# Altium project 5V-3.3V SMPS.PrjPcb
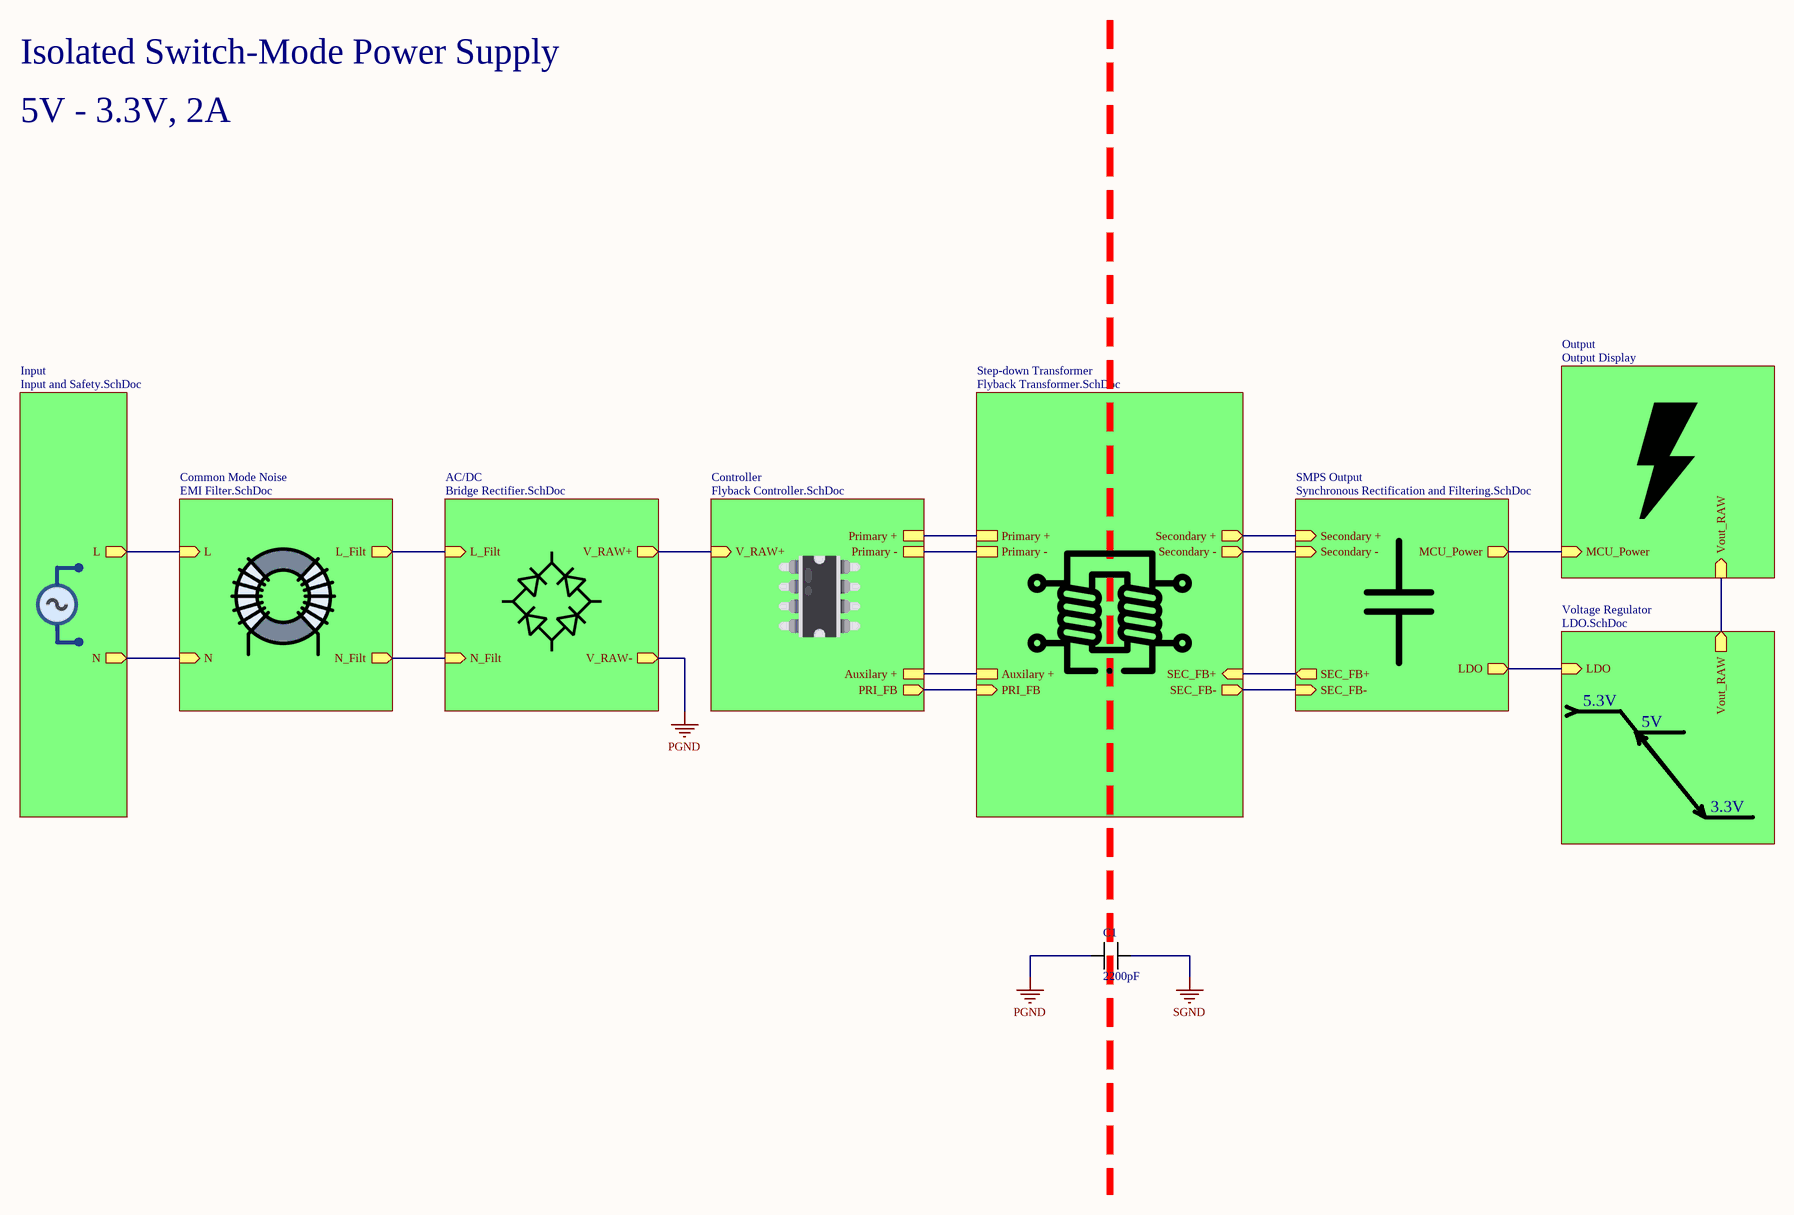
[diagram p0: System.SchDoc]
6 sheets, 56 parts. Net scope: hierarchical (ports join the sheet entries above them; power ports are global).
Board file: Power Supply.PcbDoc
Sheets:
  System.SchDoc
    Common Mode Noise = EMI Filter.SchDoc
    Controller = Flyback Controller.SchDoc
    Step-down Transformer = Flyback Transformer.SchDoc
    SMPS Output = Synchronous Rectification and Filtering.SchDoc
    Voltage Regulator = LDO.SchDoc

## Sheet System.SchDoc
size 420 x 297 mm; SheetNumber: 1; SheetTotal: 9

### Parts
C1  2200pF  [C927U222MYWDBA7317]

### Sub-sheets
AC/DC = Bridge Rectifier.SchDoc (file not in this document): V_RAW+ (out), V_RAW- (out), L_Filt (in), N_Filt (in)
Common Mode Noise = EMI Filter.SchDoc: L (in), N (in), L_Filt (out), N_Filt (out)
Controller = Flyback Controller.SchDoc: V_RAW+ (in), Auxilary +, Primary +, Primary -, PRI_FB (out)
Input = Input and Safety.SchDoc (file not in this document): L (out), N (out)
Output = Output Display (file not in this document): Vout_RAW (in), MCU_Power (in)
SMPS Output = Synchronous Rectification and Filtering.SchDoc: Secondary + (in), Secondary - (in), SEC_FB+ (out), SEC_FB- (in), LDO (out), MCU_Power (out)
Step-down Transformer = Flyback Transformer.SchDoc: Auxilary +, Primary +, Primary -, Secondary - (out), SEC_FB- (out), Secondary + (out), PRI_FB (in), SEC_FB+ (in)
Voltage Regulator = LDO.SchDoc: LDO (in), Vout_RAW (out)

### Nets
PGND: C1.1 ; sheet AC/DC/V_RAW-
SGND: C1.2
5V3: sheet Output/MCU_Power, sheet SMPS Output/LDO, sheet SMPS Output/MCU_Power, sheet Voltage Regulator/LDO
Aux+ In: sheet Controller/Auxilary +, sheet Step-down Transformer/Auxilary +
FB+: sheet Step-down Transformer/SEC_FB+, sheet SMPS Output/SEC_FB+
FB-: sheet Step-down Transformer/SEC_FB-, sheet SMPS Output/SEC_FB-
L_Filt: sheet Common Mode Noise/L_Filt, sheet AC/DC/L_Filt
N_Filt: sheet Common Mode Noise/N_Filt, sheet AC/DC/N_Filt
PRI_FB: sheet Controller/PRI_FB, sheet Step-down Transformer/PRI_FB
Primary +: sheet Controller/Primary +, sheet Step-down Transformer/Primary +
Primary -: sheet Controller/Primary -, sheet Step-down Transformer/Primary -
SEC+: sheet Step-down Transformer/Secondary +, sheet SMPS Output/Secondary +
SEC-: sheet Step-down Transformer/Secondary -, sheet SMPS Output/Secondary -
Vout_RAW: sheet Output/Vout_RAW, sheet Voltage Regulator/Vout_RAW
NetC2_1: sheet Input/L, sheet Common Mode Noise/L
NetC2_2: sheet Input/N, sheet Common Mode Noise/N
NetC3_1: sheet AC/DC/V_RAW+, sheet Controller/V_RAW+

### Notes on the sheet
- Isolated Switch-Mode Power Supply
- 5V - 3.3V, 2A
- 5.3V
- 5V
- 3.3V
- THIS DOCUMENT AND THE DATA DISCLOSED HEREIN OR
- HEREWITH IS THE PROPERTY OF ALTIUM LIMITED AND MAY
- DWG NO:
- REVISION
- REV:
- DESCRIPTION
- DATE
- APPROVED
- BE FREELY DISTRIBUTED IN WHOLE. NO RIGHTS ARE
- RESERVED OR EXPRESS OR IMPLIED WARANTEE GIVEN.
- ENG:
- APPROVALS
- PROJECT
- DSN:
- CHK:
- REFERENCE DOCUMENTS
- PROJECT REVISION:
- TITLE
- DOCUMENT REVISION:
- DESIGN ITEM:
- BOM:
- FAB DWG:
- PCB DWG:
- ASSY DWG:
- SCALE:
- A3
- SIZE
- CAGE CODE
- FILE NAME
- DWG NO.
- SHEET
- OF
- REV

### Library data of the parts
C1 = C927U222MYWDBA7317: Safety Capacitors 400/250V 2200pF Y5U 20% LS=7.5mm; Supplier 1: Mouser; Supplier Part Number 1: 80-C927U222MYWDBAP

## Sheet EMI Filter.SchDoc
size A; SheetNumber: 3; SheetTotal: 9
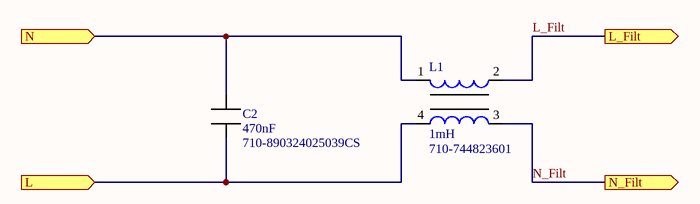
[diagram p1: EMI Filter.SchDoc]

### Parts
C2  470nF  Supplier Part Number 1: 710-890324025039CS  [890324025039CS]
L1  1mH  Supplier Part Number 1: 710-744823601  [744823601]

### Ports
L (in), L_Filt (out), N (in), N_Filt (out)

### Nets
L_Filt: L1.2 ; port L_Filt
N_Filt: L1.3 ; port N_Filt
NetC2_1: C2.1 L1.4 ; port L
NetC2_2: C2.2 L1.1 ; port N

### Library data of the parts
C2 = 890324025039CS: Safety Capacitors WCAP-FTX2 20mm Lead 0.47uF 10% 275VAC; Supplier 1: Mouser
L1 = 744823601: Common Mode Chokes / Filters WE-CMB Choke Type M 1mH 6A 13mOhm; Supplier 1: Mouser

## Sheet Flyback Controller.SchDoc
size A; SheetNumber: 5; SheetTotal: 9
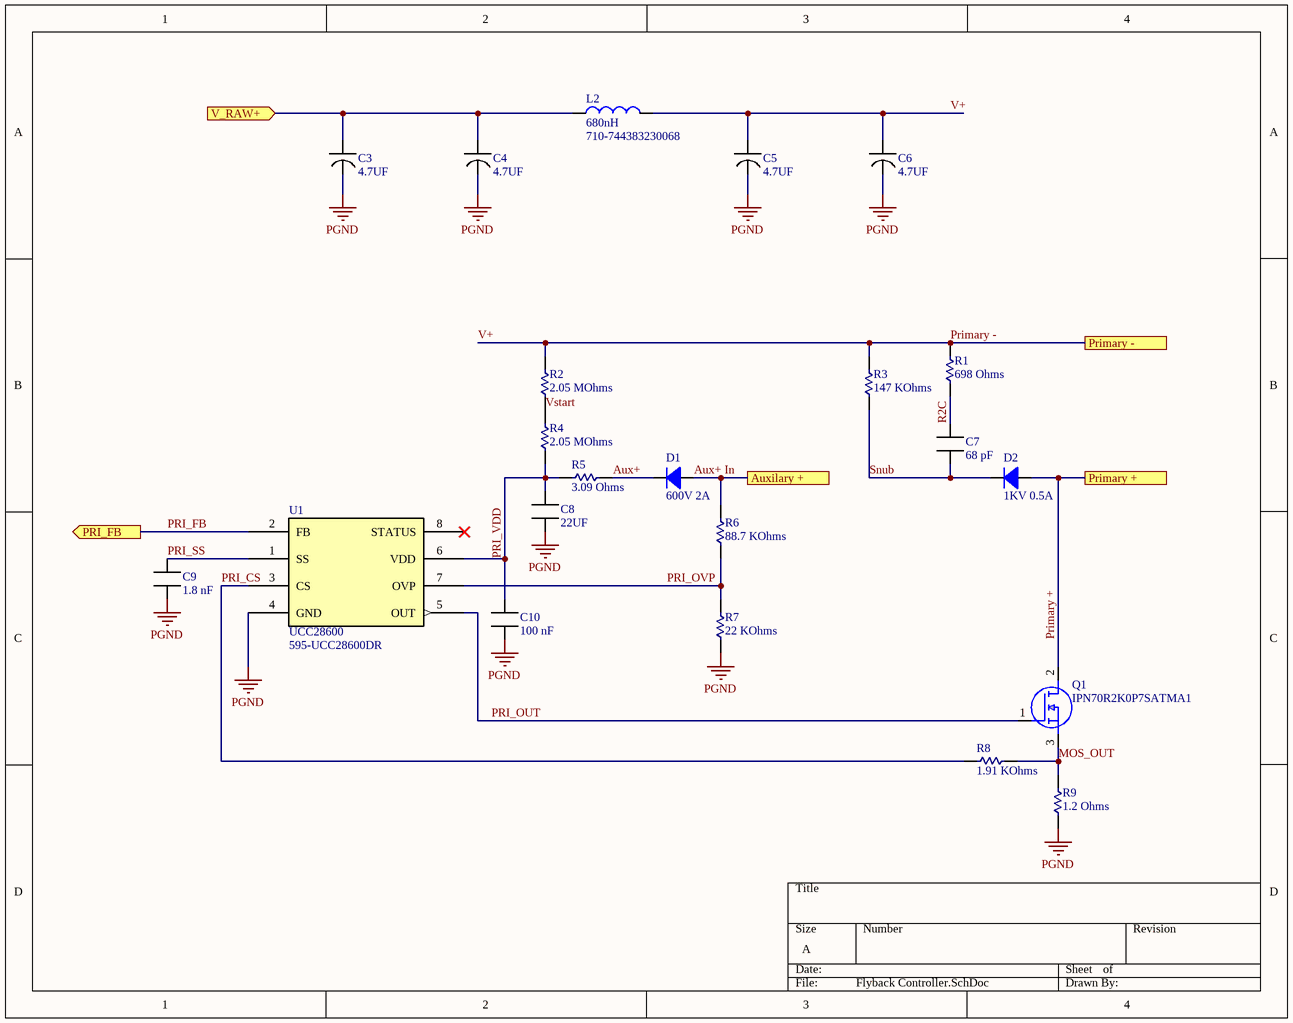
[diagram p2: Flyback Controller.SchDoc]

### Parts
C3  4.7UF  [Alum Radial Cap 5mm]
C4  4.7UF  [Alum Radial Cap 5mm]
C5  4.7UF  [Alum Radial Cap 5mm]
C6  4.7UF  [Alum Radial Cap 5mm]
C7  68 pF  [Cap 1206]
C8  22UF  [Res 0805]
C9  1.8 nF  [Cap 0603]
C10  100 nF  [Cap 1206]
D1  600V 2A  [FLAT_SMT]
D2  1KV 0.5A  [FLAT_SMT]
L2  680nH  Supplier Part Number 1: 710-744383230068  [IND 1008]
Q1  IPN70R2K0P7SATMA1  [SOT-223-3]
R1  698 Ohms  [Res 0805]
R2  2.05 MOhms  [RES 1206]
R3  147 KOhms  [Res 0805]
R4  2.05 MOhms  [RES 1206]
R5  3.09 Ohms  [Res 0805]
R6  88.7 KOhms  [Res 0805]
R7  22 KOhms  [Res 0805]
R8  1.91 KOhms  [Res 0805]
R9  1.2 Ohms  [RES 1206]
U1  UCC28600  Supplier Part Number 1: 595-UCC28600DR  [UCC28600]

### Ports
Auxilary +, PRI_FB (out), Primary +, Primary -, V_RAW+ (in)

### Nets
PGND: C3.2 C4.2 C5.2 C6.2 C8.1 C9.1 C10.1 R7.1(A) R9.1(A) U1.4(GND)
Aux+: D1.2 R5.2(B)
Aux+ In: D1.1 R6.2(B) ; port Auxilary +
MOS_OUT: Q1.3(S) R8.2(B) R9.2(B)
PRI_CS: R8.1(A) U1.3(CS)
PRI_FB: U1.2(FB) ; port PRI_FB
PRI_OUT: Q1.1(G) U1.5(OUT)
PRI_OVP: R6.1(A) R7.2(B) U1.7(OVP)
PRI_SS: C9.2 U1.1(SS)
PRI_VDD: C8.2 C10.2 R4.1(A) R5.1(A) U1.6(VDD)
Primary +: D2.1 Q1.2(D) ; port Primary +
Primary -: C5.1 C6.1 L2.2 R1.2(B) R2.2(B) R3.2(B) ; port Primary -  [also labelled V+]
R2C: C7.2 R1.1(A)
Snub: C7.1 D2.2 R3.1(A)
Vstart: R2.1(A) R4.2(B)
NetC3_1: C3.1 C4.1 L2.1 ; port V_RAW+

Not connected (* = marked no-connect by the designer): U1 8(STATUS)*

### Library data of the parts
C3-C6 = ESE475M400AH9AA: Aluminum Electrolytic Capacitors - Radial Leaded 400V 4.7uF 20% 1000Hrs; Supplier 1: Mouser; Supplier Part Number 1: 80-ESE475M400AH9AA
C7 = CC1206JKNPOCBN680: Multilayer Ceramic Capacitors MLCC - SMD/SMT 1k V 68 pF C0G 1206 5%; Supplier 1: Mouser; Supplier Part Number 1: 603-CC126JKNPOCBN680
C8 = CL21A226MAYNNNE: Multilayer Ceramic Capacitors MLCC - SMD/SMT 22uF+/-20% 25V X5R 2 0805; Supplier 1: Mouser; Supplier Part Number 1: 187-CL21A226MAYNNNE
C9 = VJ0603Y182KXACW1BC: Multilayer Ceramic Capacitors MLCC - SMD/SMT 0603 1800pF 50volts X7R 10%; Supplier 1: Mouser; Supplier Part Number 1: 77-VJ0603Y182KXACBC
C10 = CGA5L4X7T2W104M160AA: Multilayer Ceramic Capacitors MLCC - SMD/SMT CGA 1206 450V 0.1uF X7T 20% AEC-Q200; Supplier 1: Mouser; Supplier Part Number 1: 810-CGA5L4X7T2W104MA
D1 = CMF01(TE12L,Q,M): Diodes - General Purpose, Power, Switching 600V 2A M-FLAT; Supplier 1: Mouser; Supplier Part Number 1: 757-CMF01TE12LQM
D2 = CMF05(TE12L,Q,M): Rectifiers Super Fast Diode 1000V 0.5A 100ns; Supplier 1: Mouser; Supplier Part Number 1: 757-CMF05TE12LQM
L2 = 744383230068: Power Inductors - Leaded WE-MAPI 680nH 3.1A DCR=60mOhms AECQ200; Supplier 1: Mouser
Q1 = IPN70R2K0P7SATMA1: MOSFET CONSUMER 700V 3A 1.64Ohms; Supplier 1: Mouser; Supplier Part Number 1: 726-IPN70R2K0P7SATM1
R1 = RC0805FR-07698RL: Thick Film Resistors - SMD 698 Ohms 125 mW 0805 1%; Supplier 1: Mouser; Supplier Part Number 1: 603-RC0805FR-07698RL
R2 R4 = RC1206FR-072M05L: Thick Film Resistors - SMD 2.05 MOhms 250 mW 1206 1%; Supplier 1: Mouser; Supplier Part Number 1: 603-RC1206FR-072M05L
R3 = ERJ-P06F1473V: Thick Film Resistors - SMD 0805 147Kohms 0.5W 1% AEC-Q200; Supplier 1: Mouser; Supplier Part Number 1: 667-ERJ-P06F1473V
R5 = RC0805FR-073R09L: Thick Film Resistors - SMD 3.09Ohms 1/8W 0805 1%; Supplier 1: Mouser; Supplier Part Number 1: 603-RC0805FR-073R09L
R6 = ERA-6AEB8872V: Thin Film Resistors - SMD 0805 88.7Kohm 0.1% 25ppm; Supplier 1: Mouser; Supplier Part Number 1: 667-ERA-6AEB8872V
R7 = RT0805BRD0722KL: Thin Film Resistors - SMD 1/8W 22K ohm .1% 25ppm; Supplier 1: Mouser; Supplier Part Number 1: 603-RT0805BRD0722KL
R8 = CR0805-FX-1911ELF: Thick Film Resistors - SMD 1.91K 1%; Supplier 1: Mouser; Supplier Part Number 1: 652-CR0805FX-1911ELF
R9 = AC1206FR-071R2L: Thick Film Resistors - SMD 1.2Ohms 1/4W 1206 1% AEC-Q200 Standard Power Version; Supplier 1: Mouser; Supplier Part Number 1: 603-AC1206FR-071R2L
U1 = UCC28600DR: AC/DC Converters Quasi Res Flyback Green Mode Cntrlr; Supplier 1: Mouser

## Sheet Flyback Transformer.SchDoc
size A; SheetNumber: 6; SheetTotal: 9
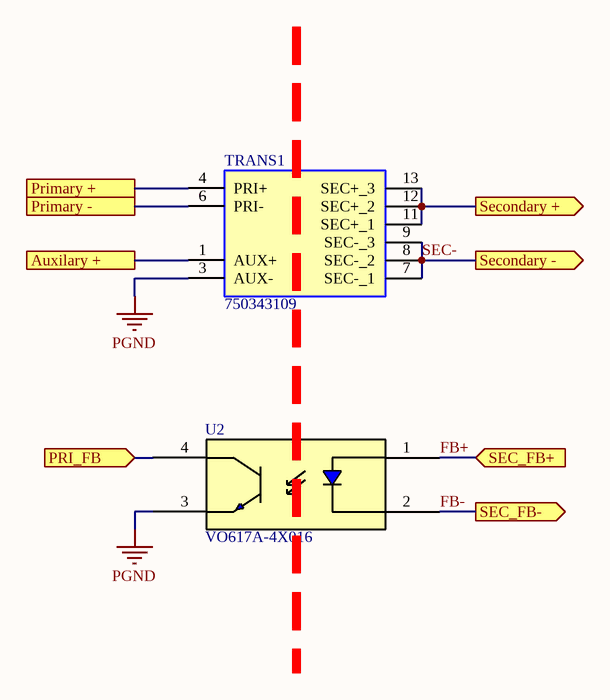
[diagram p3: Flyback Transformer.SchDoc]

### Parts
TRANS1  750343109  [750343109]
U2  VO617A-4X016  [VO617A-4X016]

### Ports
Auxilary +, PRI_FB (in), Primary +, Primary -, SEC_FB+ (in), SEC_FB- (out), Secondary + (out), Secondary - (out)

### Nets
PGND: TRANS1.3(AUX-) U2.3(E)
Aux+ In: TRANS1.1(AUX+) ; port Auxilary +
FB+: U2.1(A) ; port SEC_FB+
FB-: U2.2(C) ; port SEC_FB-
PRI_FB: U2.4(C) ; port PRI_FB
Primary +: TRANS1.4(PRI+) ; port Primary +
Primary -: TRANS1.6(PRI-) ; port Primary -
SEC+: TRANS1.11(SEC+_1) TRANS1.12(SEC+_2) TRANS1.13(SEC+_3) ; port Secondary +
SEC-: TRANS1.7(SEC-_1) TRANS1.8(SEC-_2) TRANS1.9(SEC-_3) ; port Secondary -

### Library data of the parts
TRANS1 = 750343109: Power Transformers WE-FB SMD Flyback Dialog Semi iW1830; Supplier 1: Mouser; Supplier Part Number 1: 710-750343109
U2 = VO617A-4X016: Transistor Output Optocouplers RECOMMENDED ALT 782-SFH617A-4X016; Supplier 1: Mouser; Supplier Part Number 1: 78-VO617A-4X016

## Sheet Synchronous Rectification and Filtering.SchDoc
size A; SheetNumber: 7; SheetTotal: 9
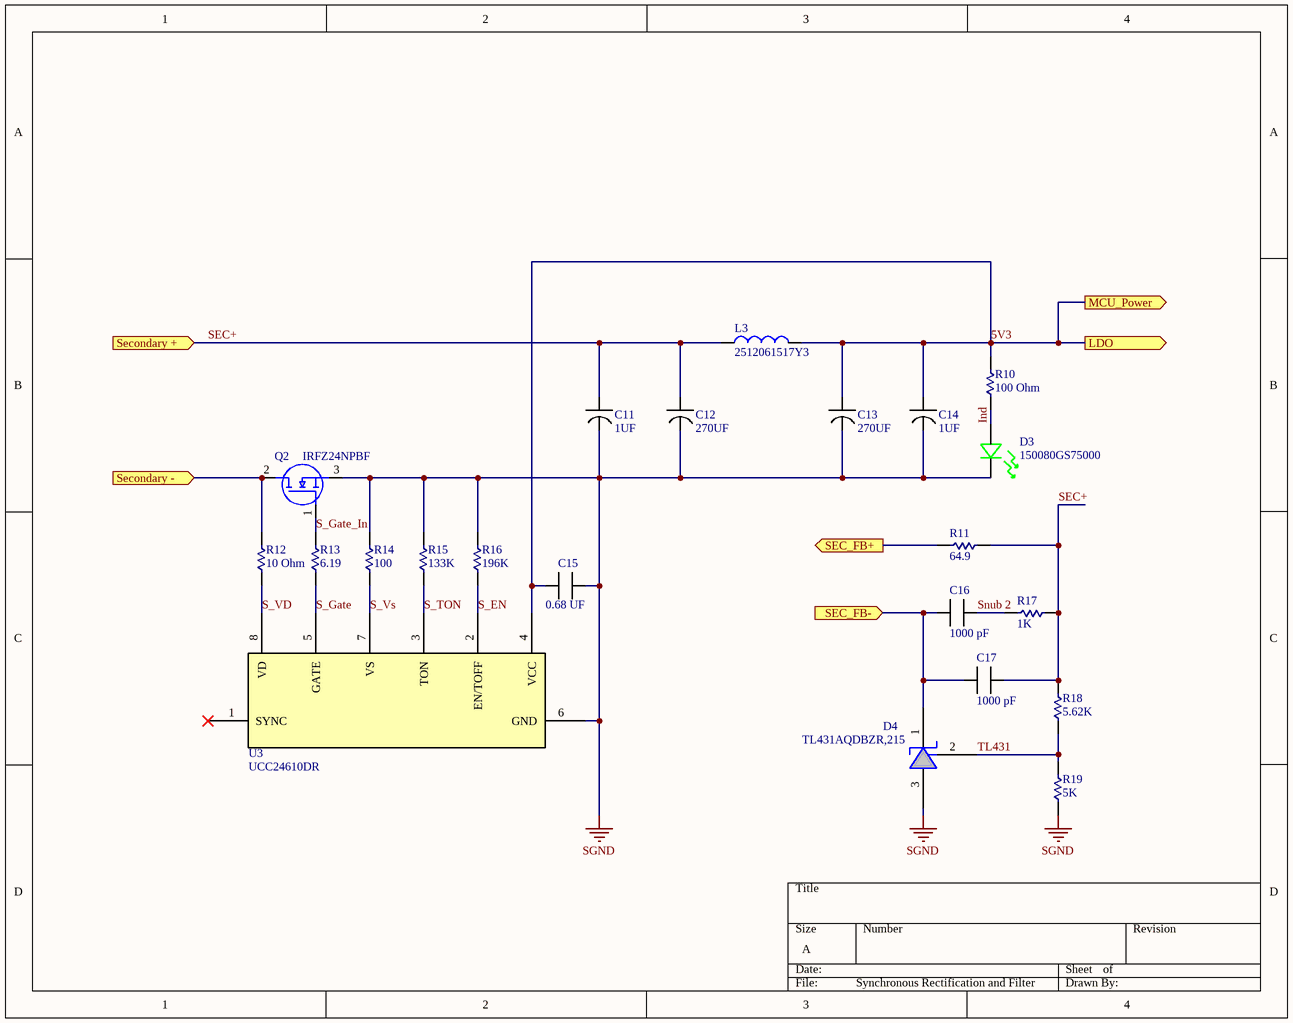
[diagram p4: Synchronous Rectification and Filtering.SchDoc]

### Parts
C11  1UF  [CAP TANTALUM 1206]
C12  270UF  [Alum Radial Cap 5mm]
C13  270UF  [Alum Radial Cap 5mm]
C14  1UF  [CAP TANTALUM 1206]
C15  0.68 UF  [Res 0805]
C16  1000 pF  [Cap 0603]
C17  1000 pF  [Cap 0603]
D3  150080GS75000  [Res 0805]
D4  TL431AQDBZR,215  [SOT23(TO-236AB)_NEX]
L3  2512061517Y3  [IND 1206]
Q2  IRFZ24NPBF  [TO-220-3]
R10  100 Ohm  [Res 0805]
R11  64.9  [Res 0805]
R12  10 Ohm  [Res 0805]
R13  6.19  [Res 0805]
R14  100  [Res 0805]
R15  133K  [Res 0805]
R16  196K  [Res 0805]
R17  1K  [Res 0805]
R18  5.62K  [Res 0805]
R19  5K  [Res 0805]
U3  UCC24610DR  [SOIC-8]

### Ports
LDO (out), MCU_Power (out), SEC_FB+ (out), SEC_FB- (in), Secondary + (in), Secondary - (in)

### Nets
SGND: C11.2 C12.2 C13.2 C14.2 C15.1 D3.1 D4.3 Q2.3(S) R14.2(B) R15.2(B) R16.2(B) R19.1(A) U3.6(GND)
5V3: C13.1 C14.1 C15.2 L3.2 R10.2(B) U3.4(VCC) ; port LDO, port MCU_Power
FB+: R11.2(B) ; port SEC_FB+
FB-: C16.2 C17.2 D4.1 ; port SEC_FB-
Ind: D3.2 R10.1(A)
S_EN: R16.1(A) U3.2(EN/TOFF)
S_Gate: R13.1(A) U3.5(GATE)
S_Gate_In: Q2.1(G) R13.2(B)
S_TON: R15.1(A) U3.3(TON)
S_VD: R12.1(A) U3.8(VD)
S_Vs: R14.1(A) U3.7(VS)
SEC+: C11.1 C12.1 C17.1 L3.1 R11.1(A) R17.1(A) R18.2(B) ; port Secondary +
SEC-: Q2.2(D) R12.2(B) ; port Secondary -
Snub 2: C16.1 R17.2(B)
TL431: D4.2 R18.1(A) R19.2(B)

Not connected (* = marked no-connect by the designer): U3 1(SYNC)*

### Library data of the parts
C11 C14 = T491A105K010AT: Tantalum Capacitors - Solid SMD 10v 1uF 1206 10% ESR=10Ohms; Supplier 1: Mouser; Supplier Part Number 1: 80-T491A105K010AT
C12 C13 = ESY277M050AH4AA: Aluminum Electrolytic Capacitors - Radial Leaded 50V 270uF 105C 4k Hour Radial; Supplier 1: Mouser; Supplier Part Number 1: 80-ESY277M050AH4AA
C15 = C0805C684K5RACAUTO7210: Multilayer Ceramic Capacitors MLCC - SMD/SMT 50V 0.68uF X7R 0805 10% AEC-Q200; Supplier 1: Mouser; Supplier Part Number 1: 80-C0805C684K5RAUTO7
C16 C17 = C0603C102K1RAC7411: Multilayer Ceramic Capacitors MLCC - SMD/SMT 100V 1000pF X7R 0603 10%; Supplier 1: Mouser; Supplier Part Number 1: 80-C0603C102K1RLR
D3 = 150080GS75000: Standard LEDs - SMD WL-SMCW SMDMono TpVw Waterclr 0805 Green; Supplier 1: Mouser; Supplier Part Number 1: 710-150080GS75000
D4 = TL431AQDBZR,215: Shunt Voltage Reference IC Adjustable 2.495V 36 VV ±1% 100 mA TO-236AB; Supplier 1: Mouser; Supplier Part Number 1: 771-TL431AQDBZR215
L3 = 2512061517Y3: Ferrite Beads MULTILAYER CHIP BEAD Z=150 OHM@100MHz 25; Supplier 1: Mouser; Supplier Part Number 1: 623-2512061517Y3
Q2 = IRFZ24NPBF: MOSFET MOSFT 55V 17A 70mOhm 13.3nC; Supplier 1: Mouser; Supplier Part Number 1: 942-IRFZ24NPBF
R10 R14 = RC0805FR-07100RL: Thick Film Resistors - SMD 100 Ohms 125 mW 0805 1%; Supplier 1: Mouser; Supplier Part Number 1: 603-RC0805FR-07100RL
R11 = RT0805FRE0764R9L: Thin Film Resistors - SMD 1/8W 64.9 ohm 1% 50ppm; Supplier 1: Mouser; Supplier Part Number 1: 603-RT0805FRE0764R9L
R12 = AR0805JR-0710RL: Thick Film Resistors - SMD 10Ohms 1/8W 0805 5% 5% AEC-Q200; Supplier 1: Mouser; Supplier Part Number 1: 603-AR0805JR-0710RL
R13 = RC0805FR-076R19L: Thick Film Resistors - SMD 6.19 Ohms 125 mW 0805 1%; Supplier 1: Mouser; Supplier Part Number 1: 603-RC0805FR-076R19L
R15 = RT0805FRE07133KL: Thin Film Resistors - SMD 1/8W 133K ohm 1% 50ppm; Supplier 1: Mouser; Supplier Part Number 1: 603-RT0805FRE07133KL
R16 = RT0805FRE07196KL: Thin Film Resistors - SMD 1/8W 196K ohm 1% 50ppm; Supplier 1: Mouser; Supplier Part Number 1: 603-RT0805FRE07196KL
R17 = AC0805FR-7W1KL: Thick Film Resistors - SMD 1 kOhms 250mW 0805 1 % AEC-Q200 Double Power Version; Supplier 1: Mouser; Supplier Part Number 1: 603-AC0805FR-7W1KL
R18 = RT0805BRD075K62L: Thin Film Resistors - SMD 1/8W 5.62K ohm .1% 25ppm; Supplier 1: Mouser; Supplier Part Number 1: 603-RT0805BRD075K62L
R19 = CRT0805-BY-5001EAS: Thin Film Resistors - SMD 5K OHM .1% 25PPM 1/8W; Supplier 1: Mouser; Supplier Part Number 1: 652-CRT0805BY5001EAS
U3 = UCC24610DR: Gate Drivers Secondary Side Sync Rectifier Controller; Supplier 1: Mouser; Supplier Part Number 1: 595-UCC24610DR

## Sheet LDO.SchDoc
size A; SheetNumber: 8; SheetTotal: 9
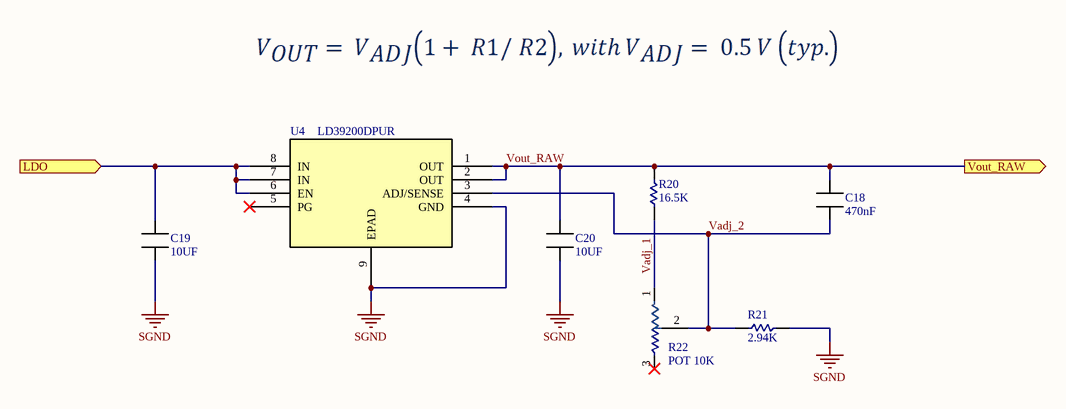
[diagram p5: LDO.SchDoc]

### Parts
C18  470nF  [Cap 0603]
C19  10UF  [Cap 0603]
C20  10UF  [Cap 0603]
R20  16.5K  [Res 0603]
R21  2.94K  [Res 0603]
R22  POT 10K  [3362P_1]
U4  LD39200DPUR  [DFN-8]

### Ports
LDO (in), Vout_RAW (out)

### Nets
SGND: C19.1 C20.1 R21.2(B) U4.4(GND) U4.9(EPAD)
5V3: C19.2 U4.6(EN) U4.7(IN) U4.8(IN) ; port LDO
Vadj_1: R20.1(A) R22.1(CCW)
Vadj_2: C18.1 R21.1(A) R22.2(WIPER) U4.3(ADJ/SENSE)
Vout_RAW: C18.2 C20.2 R20.2(B) U4.1(OUT) U4.2(OUT) ; port Vout_RAW

Not connected (* = marked no-connect by the designer): R22 3(CW)*; U4 5(PG)*

### Library data of the parts
C18 = CL10B474KO8NNND: Multilayer Ceramic Capacitors MLCC - SMD/SMT 470nF+/-10% 16V X7R 0603; Supplier 1: Mouser; Supplier Part Number 1: 187-CL10B474KO8NNND
C19 C20 = CL10A106KP8NNWC: Multilayer Ceramic Capacitors MLCC - SMD/SMT X5R, 10uF, +/-10%, 10v, 0603; Supplier 1: Mouser; Supplier Part Number 1: 187-CL10A106KP8NNWC
R20 = ERJ-PB3B1652V: Thick Film Resistors - SMD 0603 Anti-Surge Res. 0.1%, 16.5Koh; Supplier 1: Mouser; Supplier Part Number 1: 667-ERJ-PB3B1652V
R21 = RT0603BRD072K94L: Thin Film Resistors - SMD 0603 2.94Kohm 0.1% 25ppm; Supplier 1: Mouser; Supplier Part Number 1: 603-RT0603BRD072K94L
R22 = 3362H-1-103LF: Trimmer Resistors - Through Hole 1/4"SQ 10KOHMS 10% 0.5WATTS; Supplier 1: Mouser; Supplier Part Number 1: 652-3362H-1-103LF
U4 = LD39200DPUR: LDO Voltage Regulators 2 A high PSRR ultra low drop linear regulator reverse current protection; Supplier 1: Mouser; Supplier Part Number 1: 511-LD39200DPUR

## Nets that join several sheets
PGND: System (C1.1), Flyback Controller (10 pins), Flyback Transformer (TRANS1.3 U2.3)
SGND: System (C1.2), Synchronous Rectification and Filtering (13 pins), LDO (5 pins)
5V3: Synchronous Rectification and Filtering (6 pins), LDO (C19.2 U4.6 U4.7 U4.8)
Aux+ In: Flyback Controller (D1.1 R6.2), Flyback Transformer (TRANS1.1)
FB+: Flyback Transformer (U2.1), Synchronous Rectification and Filtering (R11.2)
FB-: Flyback Transformer (U2.2), Synchronous Rectification and Filtering (C16.2 C17.2 D4.1)
PRI_FB: Flyback Controller (U1.2), Flyback Transformer (U2.4)
Primary +: Flyback Controller (D2.1 Q1.2), Flyback Transformer (TRANS1.4)
Primary -: Flyback Controller (6 pins), Flyback Transformer (TRANS1.6)
SEC+: Flyback Transformer (TRANS1.11 TRANS1.12 TRANS1.13), Synchronous Rectification and Filtering (7 pins)
SEC-: Flyback Transformer (TRANS1.7 TRANS1.8 TRANS1.9), Synchronous Rectification and Filtering (Q2.2 R12.2)